# EAGLE schematic PMW3360-breakout_02_v18 (EAGLE 9.7.0)
Assembly variants: DNI
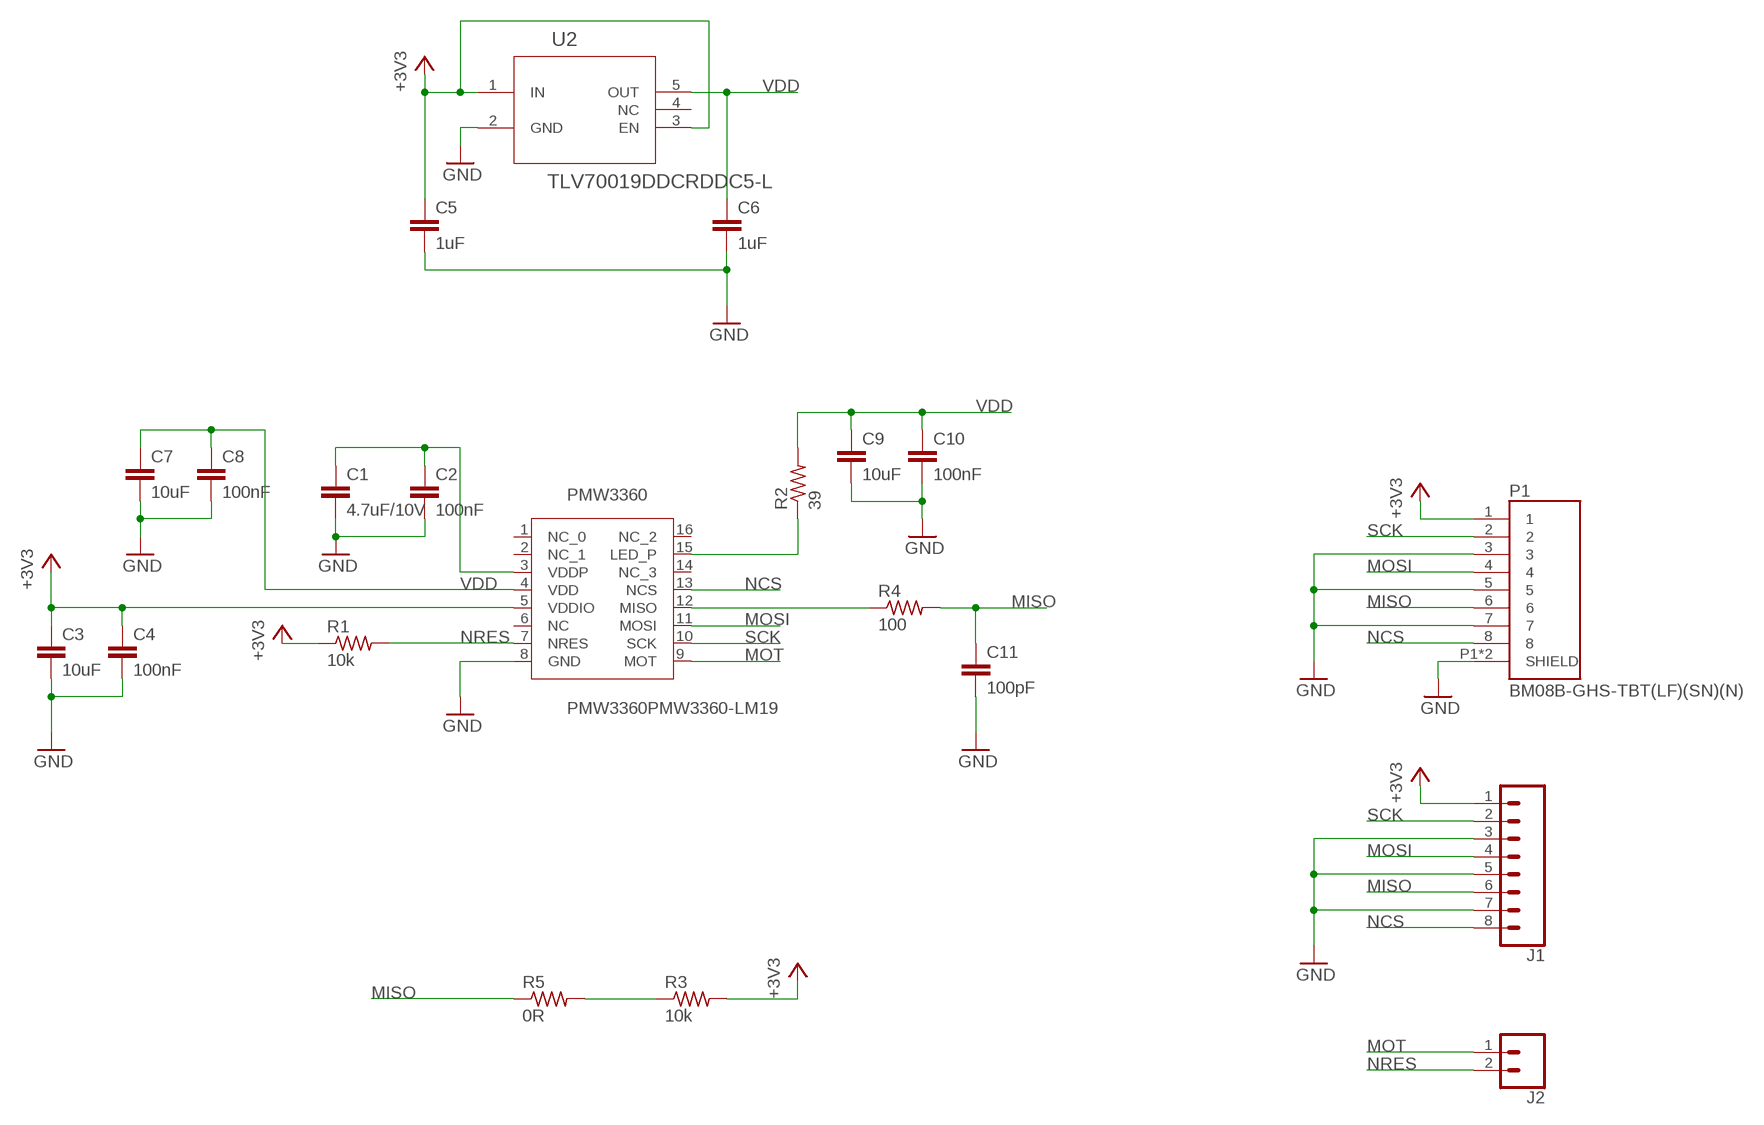
[diagram p0: schematic, sheet 1]

## Parts
C1  4.7uF/10V  C_CHIP-0603(1608-METRIC)  [CAPC1608X85]
C2  100nF  C_CHIP-0402(1005-METRIC)  [CAPC1005X60]
C3  10uF  C_CHIP-0402(1005-METRIC)  [CAPC1005X60]
C4  100nF  C_CHIP-0402(1005-METRIC)  [CAPC1005X60]
C5  1uF  C_CHIP-0402(1005-METRIC)  [CAPC1005X60]
C6  1uF  C_CHIP-0402(1005-METRIC)  [CAPC1005X60]
C7  10uF  C_CHIP-0402(1005-METRIC)  [CAPC1005X60]
C8  100nF  C_CHIP-0402(1005-METRIC)  [CAPC1005X60]
C9  10uF  C_CHIP-0402(1005-METRIC)  [CAPC1005X60]
C10  100nF  C_CHIP-0402(1005-METRIC)  [CAPC1005X60]
C11  100pF  C-EUC0402K  [C0402K]  (not fitted in variant DNI)
J1  CONN_08"  [1X08]
J2  CONN_02  [1X02]
P1  BM08B-GHS-TBT(LF)(SN)(N)  [JST_BM08B-GHS-TBT(LF)(SN)(N)]
PMW3360  PMW3360PMW3360-LM19  [PMW3360]
R1  10k  R-US_R0402  [R0402]
R2  39  R-US_R0402  [R0402]
R3  10k  R-US_R0402  [R0402]
R4  100  R-US_R0402  [R0402]
R5  0R  R-US_R0402  [R0402]
U2  TLV70019DDCRDDC5-L  [DDC5-L]

## Nets
+3V3: C3.1 C4.1 C5.1 J1.1 P1.1 PMW3360.5(VDDIO) R1.1 R3.2 U2.1(IN) U2.3(EN)
GND: C1.2 C2.2 C3.2 C4.2 C5.2 C6.2 C7.2 C8.2 C9.2 C10.2 C11.2 J1.3 J1.5 J1.7 P1.3 P1.5 P1.7 P1.P1(SHIELD) P1.P2(SHIELD) PMW3360.8(GND) U2.2(GND)
MISO: C11.1 J1.6 P1.6 R4.2 R5.1
MOSI: J1.4 P1.4 PMW3360.11(MOSI)
MOT: J2.1 PMW3360.9(MOT)
N$1: PMW3360.15(LED_P) R2.1
N$2: C1.1 C2.1 PMW3360.3(VDDP)
N$3: PMW3360.12(MISO) R4.1
N$4: R3.1 R5.2
NCS: J1.8 P1.8 PMW3360.13(NCS)
NRES: J2.2 PMW3360.7(NRES) R1.2
SCK: J1.2 P1.2 PMW3360.10(SCK)
VDD: C6.1 C7.1 C8.1 C9.1 C10.1 PMW3360.4(VDD) R2.2 U2.5(OUT)
Unconnected: PMW3360.1(NC_0) PMW3360.2(NC_1) PMW3360.6(NC) PMW3360.14(NC_3) PMW3360.16(NC_2) U2.4(NC)

## Library data of the parts
C1-C10 = Capacitor:C: Capacitor - Generic; CATEGORY: Capacitor
C11 = rcl:C-EU: CAPACITOR, European symbol; SPICEPREFIX: C
J1 = SparkFun-Connectors:CONN_08: Multi connection point. Often used as Generic Header-pin footprint for 0.1 inch spaced/style header connections On any of the 0.1 inch spaced packages, you can populate with these: Break Away Headers - Straight <https://www.sparkfun.com/products/116> (PRT-00116) Break Away Male Headers - Right Angle <https://www.sparkfun.com/products/553> (PRT-00553) Female Headers <https://www.sparkfun.com/products/115> (PRT-00115) Break Away Headers - Machine Pin <https://www.sparkfun.com/products/117> (PRT-00117) Break Away Female Headers - Swiss Machine Pin <https://www.sparkfun.com/products/743> (PRT-00743) Arduino Stackable Header - 8 Pin <https://www.sparkfun.com/products/9279> (PRT-09279) For SCREWTERMINALS and SPRING TERMINALS visit here: Screw Terimnals on SparkFun.com <https://www.sparkfun.com/search/results?term=Screw+Terminals> (5mm/3.5mm/2.54mm spacing) This device is also useful as a general connection point to wire up your design to another part of your project. Our various solder wires solder well into these plated through hole pads. Hook-Up Wire - Assortment (Stranded, 22 AWG) <https://www.sparkfun.com/products/11375> (PRT-11375) Hook-Up Wire - Assortment (Solid Core, 22 AWG) <https://www.sparkfun.com/products/11367> (PRT-11367) View the entire wire category on our website here <https://www.sparkfun.com/categories/141> Special notes: Molex polarized connector foot print use with SKU : PRT-08231 with associated crimp pins and housings. 1MM SMD Version SKU: PRT-10208 NOTES ON THE VARIANTS LOCK and LOCK_LONGPADS... This footprint was designed to help hold the alignment of a through-hole component (i.e. 6-pin header) while soldering it into place. You may notice that each hole has been shifted either up or down by 0.005 of an inch from it's more standard position (which is a perfectly straight line). This slight alteration caused the pins (the squares in the middle) to touch the edges of the holes. Because they are alternating, it causes a "brace" to hold the component in place. 0.005 has proven to be the perfect amount of "off-center" position when using our standard breakaway headers. Although looks a little odd when you look at the bare footprint, once you have a header in there, the alteration is very hard to notice. Also,if you push a header all the way into place, it is covered up entirely on the bottom side.; PROD_ID: CONN-08438
J2 = SparkFun-Connectors:CONN_02: Multi connection point. Often used as Generic Header-pin footprint for 0.1 inch spaced/style header connections On any of the 0.1 inch spaced packages, you can populate with these: Break Away Headers - Straight <https://www.sparkfun.com/products/116> (PRT-00116) Break Away Male Headers - Right Angle <https://www.sparkfun.com/products/553> (PRT-00553) Female Headers <https://www.sparkfun.com/products/115> (PRT-00115) Break Away Headers - Machine Pin <https://www.sparkfun.com/products/117> (PRT-00117) Break Away Female Headers - Swiss Machine Pin <https://www.sparkfun.com/products/743> (PRT-00743) For SCREWTERMINALS and SPRING TERMINALS visit here: Screw Terimnals on SparkFun.com <https://www.sparkfun.com/search/results?term=Screw+Terminals> (5mm/3.5mm/2.54mm spacing) This device is also useful as a general connection point to wire up your design to another part of your project. Our various solder wires solder well into these plated through hole pads. Hook-Up Wire - Assortment (Stranded, 22 AWG) <https://www.sparkfun.com/products/11375> (PRT-11375) Hook-Up Wire - Assortment (Solid Core, 22 AWG) <https://www.sparkfun.com/products/11367> (PRT-11367) View the entire wire category on our website here <https://www.sparkfun.com/categories/141> Special notes: Molex polarized connector foot print use with: PRT-08233 with associated crimp pins and housings. 2.54_SCREWTERM for use with PRT-10571. 3.5mm Screw Terminal footprints for PRT-08084 5mm Screw Terminal footprints for use with PRT-08432
P1 = BM08B-GHS-TBT_LF__SN__N_:BM08B-GHS-TBT(LF)(SN)(N): Conn Header Gh Top 8pos 1.25mm Check availability <https://pricing.snapeda.com/parts/BM08B-GHS-TBT%28LF%29%28SN%29%28N%29/JST%20Sales/view-part?ref=eda>; AVAILABILITY: In Stock; CHECK_PRICES: https://www.snapeda.com/parts/BM08B-GHS-TBT(LF)(SN)(N)/JST+Sales+America+Inc./view-part/?ref=eda; DESCRIPTION: Connector Header Surface Mount 8 position 0.049 (1.25mm); MF: JST Sales; MP: BM08B-GHS-TBT(LF)(SN)(N); PACKAGE: None; PRICE: None; SNAPEDA_LINK: https://www.snapeda.com/parts/BM08B-GHS-TBT(LF)(SN)(N)/JST+Sales+America+Inc./view-part/?ref=snap
PMW3360 = PMW3360:PMW3360
R1-R5 = rcl:R-US_: RESISTOR, American symbol; SPICEPREFIX: R
U2 = TLV70019DDCR:TLV70019DDCR; COPYRIGHT: Copyright (C) 2024 Ultra Librarian. All rights reserved.; MANUFACTURER_PART_NUMBER: TLV70019DDCR; MFR_NAME: Texas Instruments